# EAGLE design pcb_telemetria (EAGLE 9.5.0)
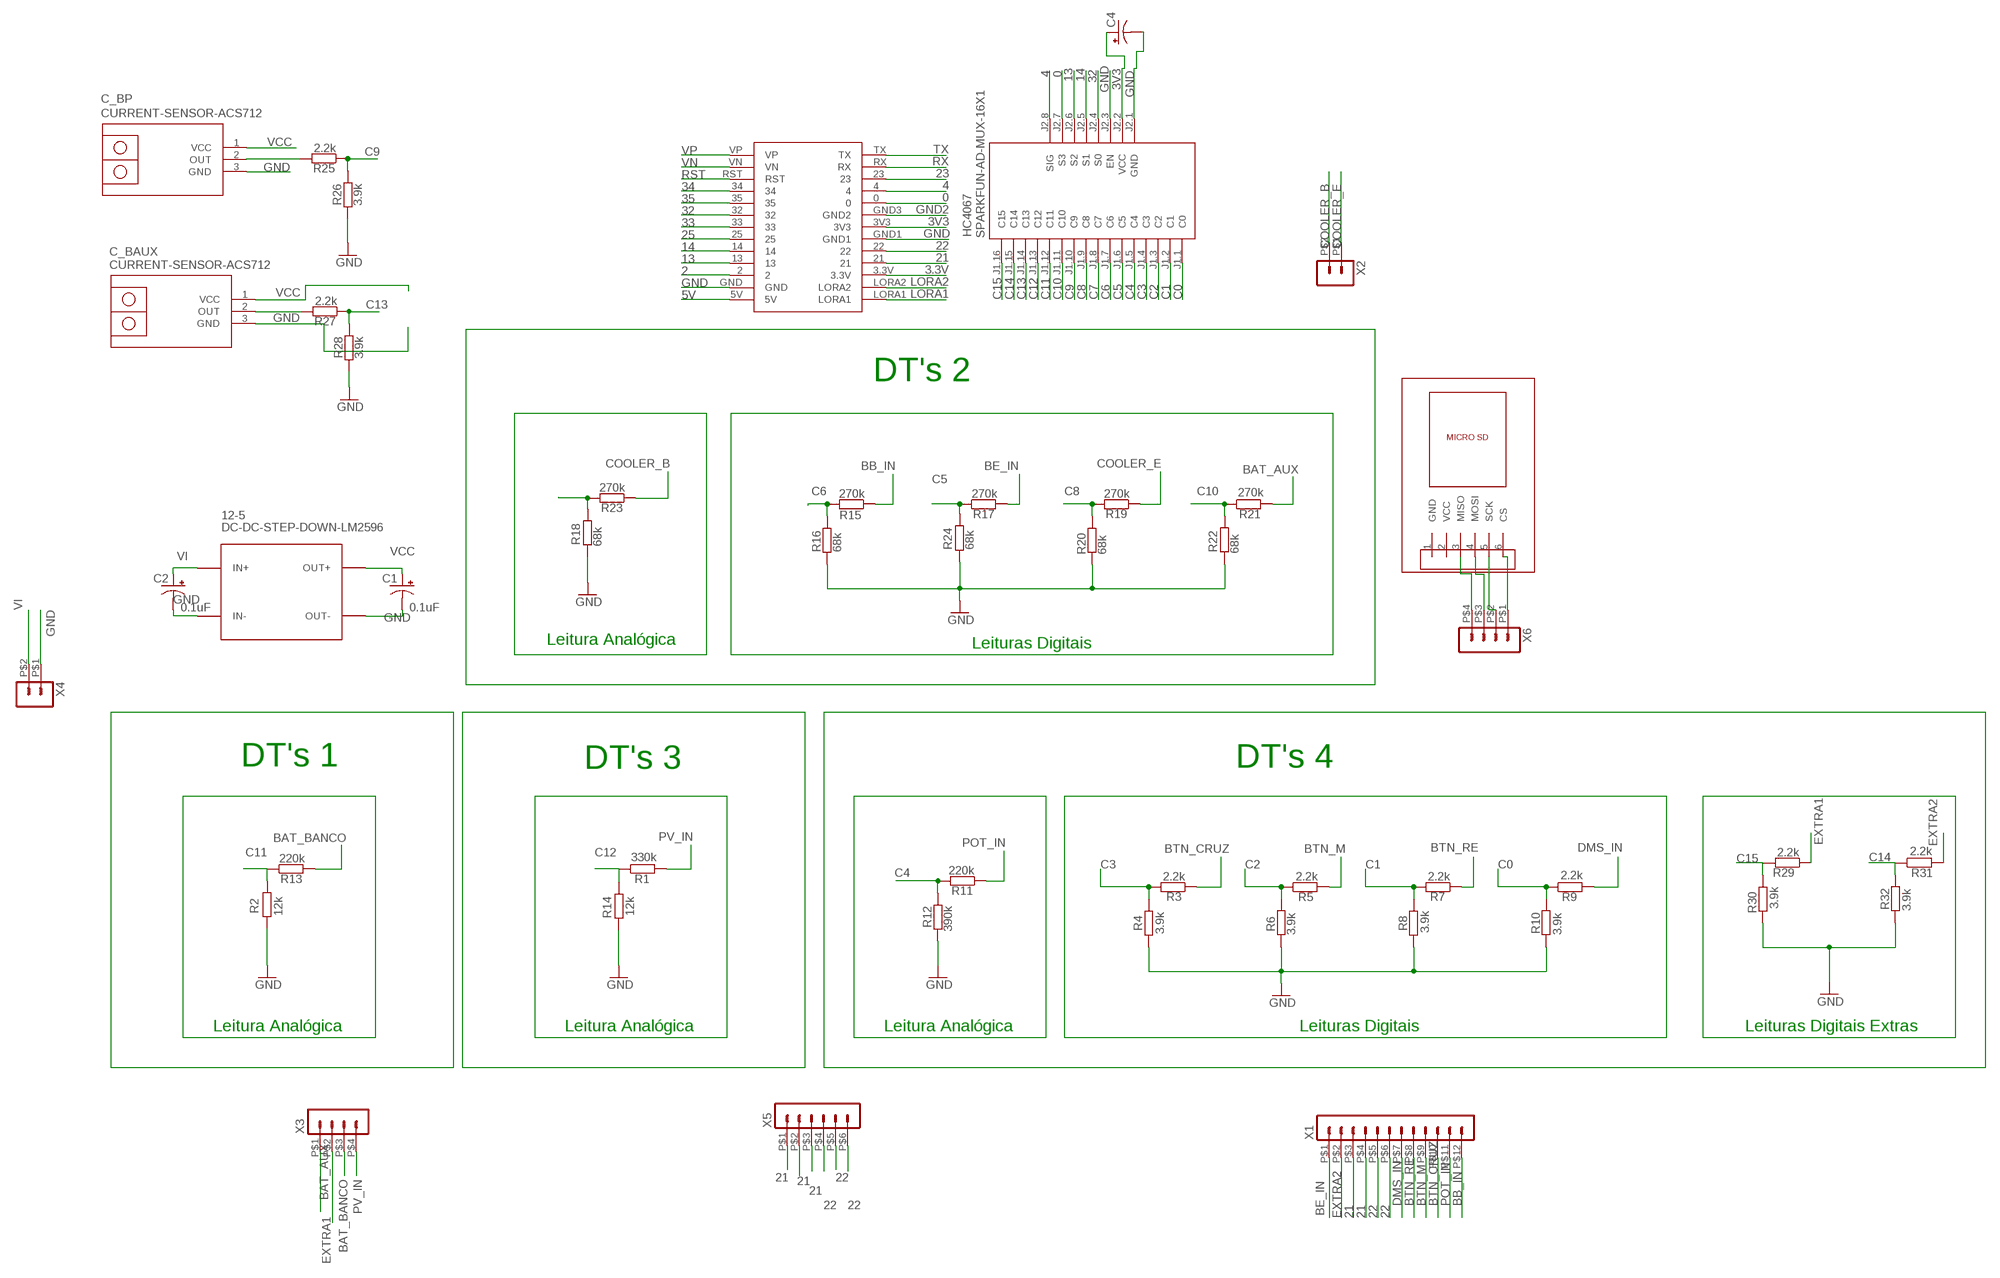
[diagram p0: schematic, sheet 1]

## Parts
12-5  DC-DC-STEP-DOWN-LM2596  [DC-DC-STEP-DOWN-LM2596]
C1  0.1uF  CPOL-USE5-5  [E5-5]
C2  0.1uF  CPOL-USE5-5  [E5-5]
C4  CPOL-USE5-5  [E5-5]
C_BAUX  CURRENT-SENSOR-ACS712  [CURRENT-SENSOR-ACS712]
C_BP  CURRENT-SENSOR-ACS712  [CURRENT-SENSOR-ACS712]
HC4067  SPARKFUN-AD-MUX-16X1  [SPARKFUN-AD-MUX-16X1]
R1  330k  R-EU_0204/7  [0204/7]
R2  12k  R-EU_0204/7  [0204/7]
R3  2.2k  R-EU_0204/7  [0204/7]
R4  3.9k  R-EU_0204/7  [0204/7]
R5  2.2k  R-EU_0204/7  [0204/7]
R6  3.9k  R-EU_0204/7  [0204/7]
R7  2.2k  R-EU_0204/7  [0204/7]
R8  3.9k  R-EU_0204/7  [0204/7]
R9  2.2k  R-EU_0204/7  [0204/7]
R10  3.9k  R-EU_0204/7  [0204/7]
R11  220k  R-EU_0204/7  [0204/7]
R12  390k  R-EU_0204/7  [0204/7]
R13  220k  R-EU_0204/7  [0204/7]
R14  12k  R-EU_0204/7  [0204/7]
R15  270k  R-EU_0204/7  [0204/7]
R16  68k  R-EU_0204/7  [0204/7]
R17  270k  R-EU_0204/7  [0204/7]
R18  68k  R-EU_0204/7  [0204/7]
R19  270k  R-EU_0204/7  [0204/7]
R20  68k  R-EU_0204/7  [0204/7]
R21  270k  R-EU_0204/7  [0204/7]
R22  68k  R-EU_0204/7  [0204/7]
R23  270k  R-EU_0204/7  [0204/7]
R24  68k  R-EU_0204/7  [0204/7]
R25  2.2k  R-EU_0204/7  [0204/7]
R26  3.9k  R-EU_0204/7  [0204/7]
R27  2.2k  R-EU_0204/7  [0204/7]
R28  3.9k  R-EU_0204/7  [0204/7]
R29  2.2k  R-EU_0204/7  [0204/7]
R30  3.9k  R-EU_0204/7  [0204/7]
R31  2.2k  R-EU_0204/7  [0204/7]
R32  3.9k  R-EU_0204/7  [0204/7]
U$1  TTGOBEAM  [TTGOBEAM]
U$2  MICRO_SD_MODULE  [MICRO_SD]
X1  HEADER_POS12_43045-1212  [43045-1212]
X2  HEADER_POS2_43045-0212  [43045-0212]
X3  HEADER_POS4_43045-0412  [43045-0412]
X4  HEADER_POS2_43045-0212  [43045-0212]
X5  HEADER_POS6_43045-0612  [43045-0612]
X6  HEADER_POS4_43045-0412  [43045-0412]

## Nets
0: HC4067.J2.7(S3) U$1.0
2: U$1.2
3.3V: U$1.3.3V
3V3: C4.+ HC4067.J2.2(VCC) U$1.3V3
4: HC4067.J2.8(SIG) U$1.4
5V: U$1.5V
13: HC4067.J2.6(S2) U$1.13
14: HC4067.J2.5(S1) U$1.14
21: U$1.21 X1.P$3 X1.P$4 X5.P$1 X5.P$2 X5.P$3
22: U$1.22 X1.P$5 X1.P$6 X5.P$4 X5.P$5 X5.P$6
23: U$1.23
25: U$1.25
32: HC4067.J2.4(S0) U$1.32
33: U$1.33
34: U$1.34
35: U$1.35
BAT_AUX: R21.2 X3.P$1
BAT_BANCO: R13.2 X3.P$3
BB_IN: R15.1 X1.P$12
BE_IN: R17.2 X1.P$1
BTN_CRUZ: R3.1 X1.P$10
BTN_M: R5.2 X1.P$9
BTN_RE: R7.1 X1.P$8
C0: HC4067.J1.1(C0) R9.1 R10.2
C1: HC4067.J1.2(C1) R7.2 R8.1
C2: HC4067.J1.3(C2) R5.1 R6.2
C3: HC4067.J1.4(C3) R3.2 R4.1
C4: HC4067.J1.5(C4) R11.2 R12.1
C5: HC4067.J1.6(C5) R17.1 R24.1
C6: HC4067.J1.7(C6) R15.2 R16.1
C7: HC4067.J1.8(C7) R18.2 R23.2
C8: HC4067.J1.9(C8) R19.2 R20.1
C9: HC4067.J1.10(C9) R25.1 R26.1
C10: HC4067.J1.11(C10) R21.1 R22.2
C11: HC4067.J1.12(C11) R2.2 R13.1
C12: HC4067.J1.13(C12) R1.1 R14.2
C13: HC4067.J1.14(C13) R27.1 R28.1
C14: HC4067.J1.15(C14) R31.1 R32.2
C15: HC4067.J1.16(C15) R29.2 R30.1
COOLER_B: R23.1 X2.P$2
COOLER_E: R19.1 X2.P$1
DMS_IN: R9.2 X1.P$7
EXTRA1: R29.1 X3.P$2
EXTRA2: R31.2 X1.P$2
GND: 12-5.IN- 12-5.OUT- C1.- C2.- C4.- C_BAUX.3(GND) C_BP.3(GND) HC4067.J2.1(GND) HC4067.J2.3(EN) R2.1 R4.2 R6.1 R8.2 R10.1 R12.2 R14.1 R16.2 R18.1 R20.2 R22.1 R26.2 R28.2 R30.2 R32.1 U$1.GND U$1.GND1 X4.P$1
GND2: U$1.GND3(GND2)
GND3: R24.2
LORA1: U$1.LORA1
LORA2: U$1.LORA2
N$1: C_BP.2(OUT) R25.2
N$2: C_BAUX.2(OUT) R27.2
N$3: U$2.3(MISO) X6.P$4
N$4: U$2.4(MOSI) X6.P$3
N$6: U$2.6(CS) X6.P$1
N$7: U$2.5(SCK) X6.P$2
POT_IN: R11.1 X1.P$11
PV_IN: R1.2 X3.P$4
RST: U$1.RST
RX: U$1.RX
TX: U$1.TX
VCC: 12-5.OUT+ C1.+ C_BAUX.1(VCC) C_BP.1(VCC)
VI: 12-5.IN+ C2.+ X4.P$2
VN: U$1.VN
VP: U$1.VP
Unconnected: U$2.1(GND) U$2.2(VCC)

## Notes on the sheet
- DT's 2
- Leitura Analógica | Leituras Digitais
- DT's 1 | DT's 3 | DT's 4
- Leitura Analógica | Leitura Analógica | Leitura Analógica | Leituras Digitais | Leituras Digitais Extras

## Library data of the parts
12-5 = diy-modules:DC-DC-STEP-DOWN-LM2596: DC/DC Step-Down Regulator based on LM2596-ADJ chip LM2596 datasheet available here: http://www.ti.com/lit/ds/symlink/lm2596.pdf Click here to find device on ebay.com <http://www.ebay.com/sch/lm2596+power+regulator>
C1 C2 C4 = rcl:CPOL-US: POLARIZED CAPACITOR, American symbol; SPICEPREFIX: C
C_BAUX C_BP = diy-modules:CURRENT-SENSOR-ACS712: Isolated Bipolar Current Sensors based on ACS712 chip More details available here: http://embedded-lab.com/blog/a-brief-overview-of-allegro-acs712-current-sensor-part-1/ Click here to find device on ebay.com <http://www.ebay.com/sch/acs712+module> Note: There are many available versions with different pinout. Please check before use
HC4067 = diy-modules:SPARKFUN-AD-MUX-16X1: SparkFun Analog/Digital MUX Breakout based on CD74HC4067 chip Source: https://www.sparkfun.com/products/9056
R1-R32 = rcl:R-EU_: RESISTOR, European symbol; SPICEPREFIX: R
U$1 = bibliotecattgo:TTGOBEAM
U$2 = bibliotecattgo:MICRO_SD_MODULE: Micro SD module
X1 = con-molex-micro-fit-3_0:HEADER_POS12_?: Molex - Micro-Fit 3.0 Series connector, 3.00mm (0.118") pitch header, 12 positions.
X2 X4 = con-molex-micro-fit-3_0:HEADER_POS2_?: Molex - Micro-Fit 3.0 Series connector, 3.00mm (0.118") pitch header, 2 positions.
X3 X6 = con-molex-micro-fit-3_0:HEADER_POS4_?: Molex - Micro-Fit 3.0 Series connector, 3.00mm (0.118") pitch header, 4 positions.
X5 = con-molex-micro-fit-3_0:HEADER_POS6_?: Molex - Micro-Fit 3.0 Series connector, 3.00mm (0.118") pitch header, 6 positions.

## Board
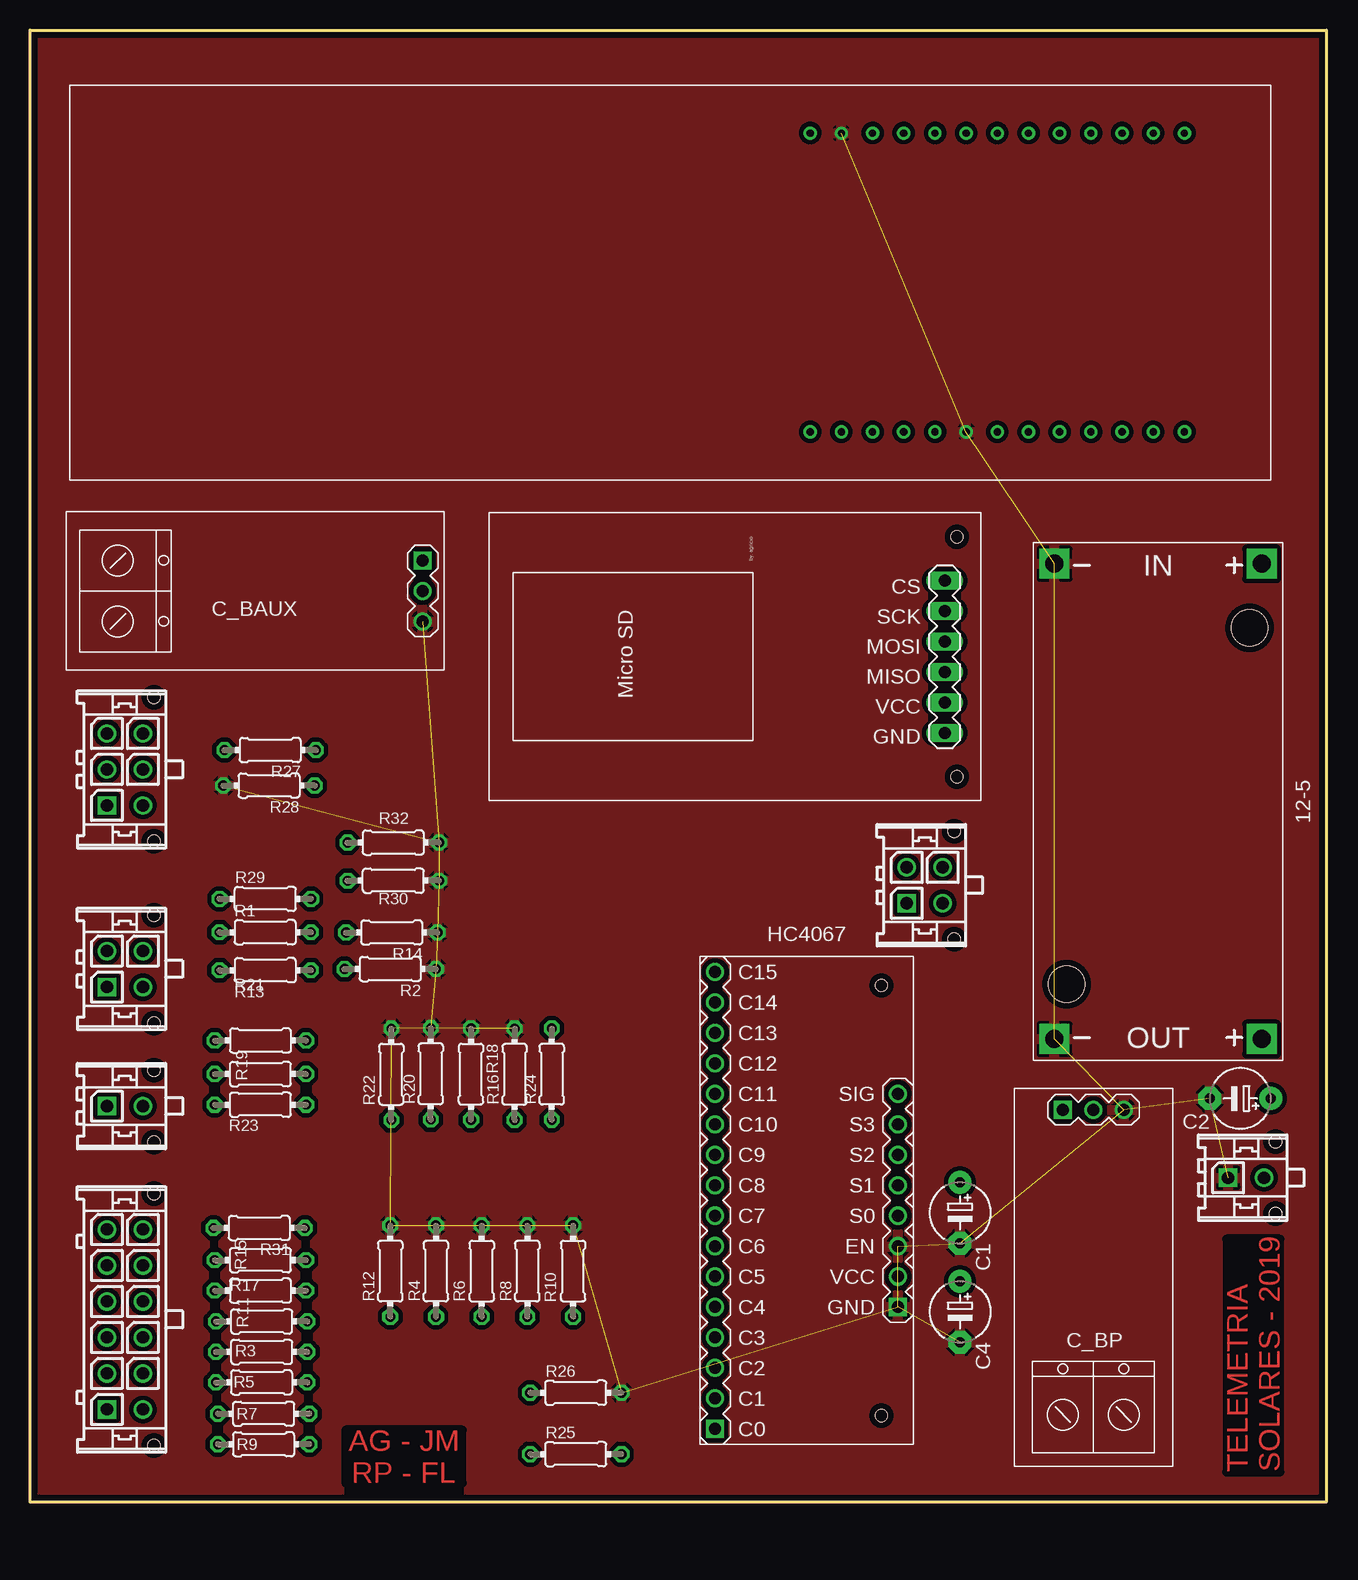
[diagram p1: board, top side]
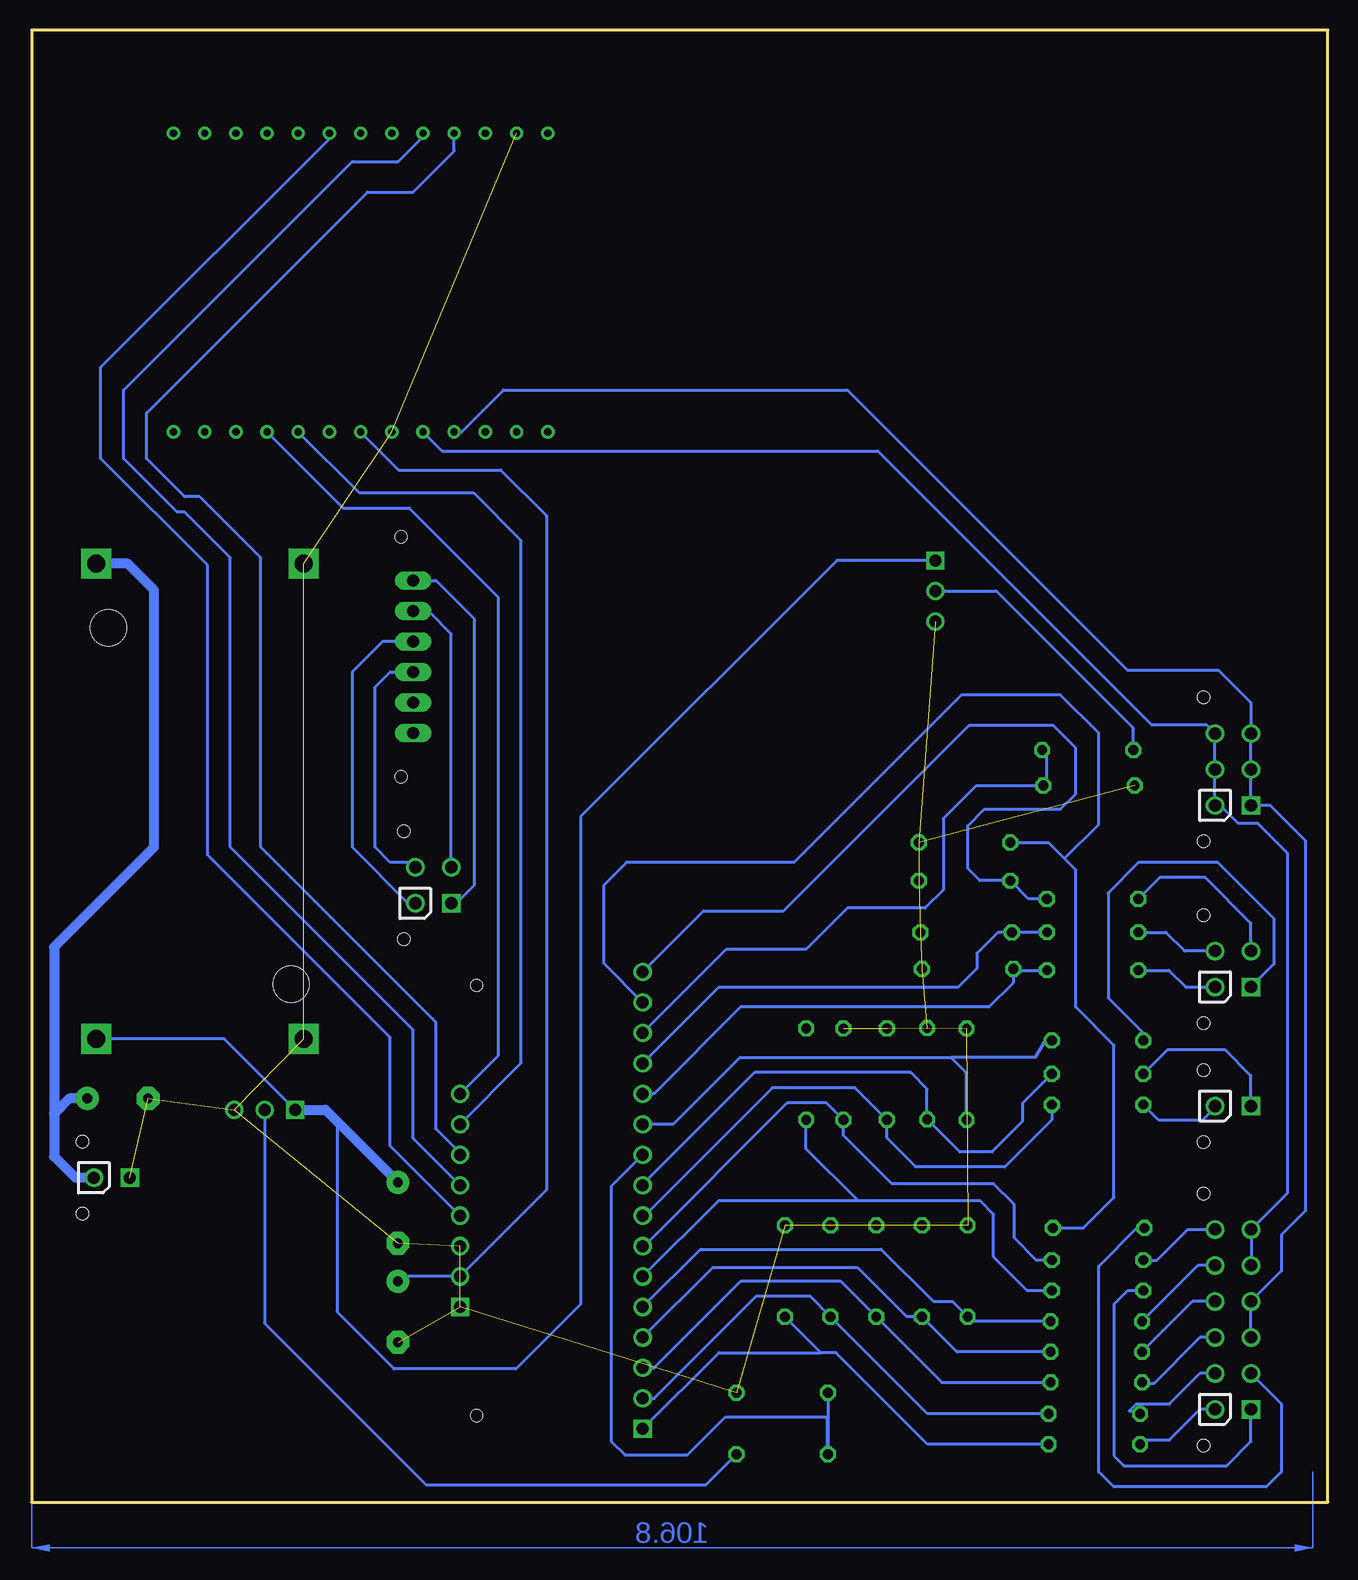
[diagram p2: board, bottom side, seen from below]

Size 108.07 x 122.73 mm. Coordinates in mm from the lower left corner, seen from the top.
Outline: 0,0 0,122.73 108.07,122.73 108.07,0 0,0
Copper layers (1*16): Top 0.035mm / dielectric 1.5mm / Bottom 0.035mm
Design rules "default *": minimum track width 10mil, minimum drill 0.35mm, track to track 15mil, track to pad 15mil, pad to pad 15mil, via to via 15mil, smd to smd 15mil, copper to edge 20mil, drill to drill 24mil, minimum pad ring 10mil, minimum via ring 8mil, stop-mask expansion 4mil, vias tented up to drill 0mil, thermal gap 10mil

### Footprints (pad centres in the part's own frame; a part is rotated, then mirrored left to right if it is on the bottom)
DC-DC-STEP-DOWN-LM2596 = drill 1.5 pad 2.5 square: IN+ -19.812,8.636; IN- -19.812,-8.636; OUT+ 19.812,8.636; OUT- 19.812,-8.636 | hole 3: -14.478,7.62; 15.24,-7.62
E5-5 = drill 0.813 pad 1.905: + -2.54,0 | drill 0.813 pad 1.905 octagon: - 2.54,0
CURRENT-SENSOR-ACS712 = drill 1 square: 1 13.97,2.54 | drill 1: 2 13.97,0; 3 13.97,-2.54
SPARKFUN-AD-MUX-16X1 = drill 1 square: J1.1 -7.62,-19.05; J2.1 7.62,-8.89 | drill 1: J1.2 -7.62,-16.51; J1.3 -7.62,-13.97; J1.4 -7.62,-11.43; J1.5 -7.62,-8.89; J1.6 -7.62,-6.35; J1.7 -7.62,-3.81; J1.8 -7.62,-1.27; J1.9 -7.62,1.27; J1.10 -7.62,3.81; J1.11 -7.62,6.35; J1.12 -7.62,8.89; J1.13 -7.62,11.43; J1.14 -7.62,13.97; J1.15 -7.62,16.51; J1.16 -7.62,19.05; J2.2 7.62,-6.35; J2.3 7.62,-3.81; J2.4 7.62,-1.27; J2.5 7.62,1.27; J2.6 7.62,3.81; J2.7 7.62,6.35; J2.8 7.62,8.89 | hole 1: 6.245,-17.93; 6.245,17.93
0204/7 = drill 0.813 octagon: 1 -3.81,0; 2 3.81,0
TTGOBEAM = drill 0.6: 0 11.9,5.8; 2 -13,-9.8; 3.3V 11.9,-9.8; 3V3 11.9,0.6; 4 11.9,8.4; 5V -13,-15; 13 -13,-7.2; 14 -13,-4.6; 21 11.9,-7.2; 22 11.9,-4.6; 23 11.9,11; 25 -13,-2; 32 -13,3.2; 33 -13,0.6; 34 -13,8.4; 35 -13,5.8; GND -13,-12.4; GND1 11.9,-2; GND3 11.9,3.2; LORA1 11.9,-15; LORA2 11.9,-12.4; RST -13,11; RX 11.9,13.6; TX 11.9,16.2; VN -13,13.6; VP -13,16.2
MICRO_SD = drill 1.016 long: 1 -6.35,0; 2 -3.81,0; 3 -1.27,0; 4 1.27,0; 5 3.81,0; 6 6.35,0 | hole 1: -10,-1; 10,-1
43045-1212 = drill 1.02 square: P$1 7.5,0 | drill 1.02: P$2 4.5,0; P$3 1.5,0; P$4 -1.5,0; P$5 -4.5,0; P$6 -7.5,0; P$7 7.5,3; P$8 4.5,3; P$9 1.5,3; P$10 -1.5,3; P$11 -4.5,3; P$12 -7.5,3 | hole 1.02: 10.5,3.94; -10.5,3.94
43045-0212 = drill 1.02 square: P$1 0,0 | drill 1.02: P$2 0,3 | hole 1.02: 3,3.94; -3,3.94
43045-0412 = drill 1.02 square: P$1 1.5,0 | drill 1.02: P$2 -1.5,0; P$3 1.5,3; P$4 -1.5,3 | hole 1.02: 4.5,3.94; -4.5,3.94
43045-0612 = drill 1.02 square: P$1 3,0 | drill 1.02: P$2 0,0; P$3 -3,0; P$4 3,3; P$5 0,3; P$6 -3,3 | hole 1.02: 6,3.94; -6,3.94

### Placement (x,y rotation side)
12-5  94.04,58.42 270 top
C1  77.53,24.13 270 top
C2  100.9,33.66 180 top
C4  77.53,15.88 270 top
C_BAUX  18.76,75.97 0 top
C_BP  88.65,18.74 90 top
HC4067  64.74,25.16 0 top
R1  19.61,47.51 180 top
R2  30.03,44.45 180 top
R3  19.31,12.53 0 top
R4  33.84,19.27 90 top
R5  19.31,9.99 180 top
R6  37.65,19.27 270 top
R7  19.47,7.37 0 top
R8  41.46,19.27 90 top
R9  19.47,4.83 180 top
R10  45.27,19.27 270 top
R11  19.31,15.07 0 top
R12  30.03,19.27 90 top
R13  19.61,44.35 180 top
R14  30.16,47.5 180 top
R15  19.21,20.18 0 top
R16  40.4,35.68 90 top
R17  19.21,17.64 180 top
R18  36.76,35.69 270 top
R19  19.21,35.7 0 top
R20  33.41,35.72 90 top
R21  19.21,38.49 180 top
R22  30.12,35.68 270 top
R23  19.21,33.14 0 top
R24  43.49,35.69 90 top
R25  45.5,4.01 0 top
R26  45.5,9.13 0 top
R27  20.02,62.7 180 top
R28  19.92,59.74 180 top
R29  19.62,50.29 0 top
R30  30.29,51.82 0 top
R31  19.11,22.86 180 top
R32  30.29,54.99 180 top
U$1  80.04,101.13 270 top
U$2  76.26,70.48 90 top
X1  6.41,15.24 270 top
X2  6.41,33.02 270 top
X3  6.41,44.45 270 top
X4  99.88,27.05 270 top
X5  6.41,61.09 270 top
X6  73.09,51.44 270 top

### Tracks (layer width: path | path; a pad name or v marks a point on that pad's centre or on a via)
0
  Bottom 0.254: HC4067.J2.7 67.24,36.63 67.24,80.16 71.24,84.15 80.76,84.15 U$1.0
3V3
  Bottom 0.254: U$1.3V3 77.47,86.05 68.96,86.05 65.15,82.24 65.15,26.02 HC4067.J2.2 77.13,18.81 C4.+
4
  Bottom 0.254: HC4067.J2.8 69.18,37.23 69.18,75.47 76.59,82.88 82.09,82.88 U$1.4
13
  Bottom 0.254: HC4067.J2.6 72.36,29.12 74.36,31.12 74.36,40.01 88.96,54.61 88.96,78.74 94.04,83.82 95.31,83.82 98.49,86.99 98.49,90.8 80.07,109.22 76.26,109.22 72.84,112.64 U$1.13
14
  Bottom 0.254: HC4067.J2.5 76.26,30.33 76.26,39.37 91.5,54.61 91.5,78.74 95.31,82.55 95.95,82.55 100.39,86.99 100.39,92.71 81.34,111.76 77.53,111.76 75.44,113.85 U$1.14
21
  Bottom 0.254: X1.P$3 X1.P$4 3.87,19.28 3.87,22.28 1.84,24.31 1.84,55.12 4.81,58.09 X5.P$1 X5.P$2 X5.P$3 6.41,66.63 6.4,66.64 9.1,69.34 16.7,69.34 40.07,92.71 68.72,92.71 72.21,89.23 U$1.21
22
  Bottom 0.254: U$1.22 73.84,87.63 37.53,87.63 14.67,64.77 10.09,64.77 X5.P$6 X5.P$5 9.41,58.42 | X5.P$4 9.41,58.42 | X1.P$6 6.35,22.8 | 6.35,22.8 3.36,25.79 3.36,54.1 5.85,56.59 7.48,56.59 9.32,58.42 9.41,58.42 | X1.P$5 6.35,19.8 6.35,22.8
32
  Bottom 0.254: HC4067.J2.4 78.17,29.7 78.17,38.73 93.41,53.98 93.41,78.1 102.3,86.99 102.3,94.61 83.24,113.67 U$1.32
BAT_AUX
  Bottom 0.254: R21.2 15.4,39.13 18.32,42.05 18.32,50.81 15.76,53.36 9.2,53.36 4.51,48.66 4.51,44.86 X3.P$1
BAT_BANCO
  Bottom 0.254: R13.2 13.26,44.35 11.86,42.95 X3.P$3
BB_IN
  Bottom 0.254: R15.1 14.25,20.18 11.7,22.74 X1.P$12
BE_IN
  Bottom 0.254: R17.2 16.71,17.64 17.84,16.51 17.84,3.89 17,3.05 8.44,3.05 6.41,5.08 X1.P$1
BTN_CRUZ
  Bottom 0.254: R3.1 11.29,16.74 X1.P$10
BTN_M
  Bottom 0.254: R5.2 15.43,9.93 14.49,9.93 10.68,13.74 X1.P$9
BTN_RE
  Bottom 0.254: R7.1 15.9,7.61 16.56,7.61 15.98,8.2 13.22,8.2 10.68,10.74 X1.P$8
C0
  Bottom 0.254: R9.1 33.38,4.83 41.01,12.46 42.28,12.46 | 42.28,12.46 R10.2 | HC4067.J1.1 50.77,12.46 42.28,12.46
C1
  Bottom 0.254: R7.2 33.38,7.37 R8.1 43.15,17.14 47.69,17.14 56.18,8.65 HC4067.J1.2
C2
  Bottom 0.254: R5.1 32.19,9.99 R6.2 40.61,18.41 48.96,18.41 56.18,11.19 HC4067.J1.3
C3
  Bottom 0.254: R3.2 30.92,12.53 R4.1 35.11,15.46 39.23,19.57 51.28,19.57 HC4067.J1.4
C4
  Bottom 0.254: HC4067.J1.5 52.29,21.1 37.24,21.1 32.88,16.73 31.3,16.73 R12.1 29.65,15.07 R11.2
C5
  Bottom 0.254: R17.1 25.05,17.64 27.87,20.47 27.87,24 29.02,25.15 39.18,25.15 39.19,25.16 | HC4067.J1.6 50.77,25.16 39.19,25.16 | R24.1 43.49,29.46 39.19,25.16
C6
  Bottom 0.254: HC4067.J1.7 57.01,21.35 45.09,33.27 41.8,33.27 R16.1 40.4,30.6 36.34,26.54 27.87,26.54 26.19,24.86 26.19,22.09 24.29,20.18 R15.2
C7
  Bottom 0.254: HC4067.J1.8 56.96,23.89 46.31,34.54 39.43,34.54 R18.2 36.76,30.35 34.35,27.94 26.94,27.94 23.02,31.87 R23.2
C8
  Bottom 0.254: HC4067.J1.9 57.12,26.48 47.78,35.81 34.78,35.81 33.41,34.45 R20.1 30.7,29.2 28.01,29.2 25.46,31.75 25.46,33.25 R19.2
C9
  Bottom 0.254: HC4067.J1.10 59.75,26.34 59.75,5.08 58.61,3.94 53.4,3.94 50.23,7.11 41.76,7.11 41.76,4.08 R25.1 R26.1
C10
  Bottom 0.254: HC4067.J1.11 54.58,31.51 49.01,37.08 31.43,37.08 | 31.43,37.08 24.4,37.08 23.56,38.49 R21.1 | R22.2 30.12,35.77 31.43,37.08
C11
  Bottom 0.254: HC4067.J1.12 56.18,34.05 48.96,41.27 28.25,41.27 26.22,43.31 R2.2 26.22,44.35 R13.1
C12
  Bottom 0.254: HC4067.J1.13 50.77,42.94 30.82,42.94 29.27,44.49 29.27,45.76 27.49,47.54 26.39,47.54 R14.2 26.33,47.51 R1.1
C13
  Bottom 0.254: HC4067.J1.14 50.13,46.12 43.48,46.12 40.07,49.53 33.59,49.53 32.06,51.05 32.06,57 29.32,59.74 R28.1 23.45,60.02 23.45,62.32 R27.1
C14
  Bottom 0.254: R31.1 20.38,22.86 17.84,25.4 17.84,38.1 21.02,41.27 21.02,52.7 21.97,53.66 | R32.2 23.3,54.99 21.97,53.66 | 21.97,53.66 19.11,56.52 19.11,64.13 22.29,67.31 30.54,67.31 44.51,53.34 58.48,53.34 60.39,51.44 60.39,44.94 HC4067.J1.15
C15
  Bottom 0.254: R29.2 24.95,50.29 R30.1 29.02,51.82 30.03,52.83 30.03,56.39 28.64,57.79 22.29,57.79 21.02,59.05 21.02,62.87 22.92,64.77 29.91,64.77 45.38,49.29 52.04,49.29 HC4067.J1.16
COOLER_B
  Bottom 0.254: X2.P$2 9.28,33.02 10.43,31.88 14.14,31.88 R23.1
COOLER_E
  Bottom 0.254: X2.P$1 6.41,35.56 8.57,37.72 13.38,37.72 R19.1
DMS_IN
  Bottom 0.254: X1.P$7 10.68,7.74 13.22,5.2 15.29,5.2 R9.2
EXTRA1
  Bottom 0.254: X3.P$2 6.41,48.26 10.22,52.07 14.03,52.07 R29.1
EXTRA2
  Bottom 0.254: X1.P$2 3.87,8.2 3.87,2.54 5.14,1.27 17.84,1.27 19.11,2.54 19.11,19.69 15.94,22.86 R31.2
GND  (26 unrouted)
  pour Top: -7.56,122.55 -7.56,-16.51 -5.02,-19.05 123.89,-19.05 125.79,-17.15 125.79,109.85 110.55,125.09 -5.65,125.09 -8.19,122.55
N$1
  Bottom 0.254: C_BP.2 88.65,14.93 75.19,1.47 51.85,1.47 R25.2
N$2
  Bottom 0.254: C_BAUX.2 27.65,75.97 16.21,64.53 R27.2
N$3
  Bottom 0.254: X6.P$4 76.49,53.34 78.17,53.34 79.44,54.61 79.44,67.94 78.17,69.22 U$2.3
N$4
  Bottom 0.254: U$2.4 78.8,71.75 81.34,69.22 81.34,54.61 76.67,49.94 X6.P$3
N$6
  Bottom 0.254: U$2.6 74.36,76.83 71.18,73.66 71.18,51.44 72.68,49.94 X6.P$1
N$7
  Bottom 0.254: X6.P$2 73.09,72.39 74.99,74.29 U$2.5
POT_IN
  Bottom 0.254: R11.1 10.83,19.74 X1.P$11
PV_IN
  Bottom 0.254: R1.2 13.51,47.51 11.95,45.95 X3.P$4
VCC
  Bottom 0.254: C_BAUX.1 40.93,78.51 62.29,57.15 62.29,16.51 67.69,11.11 77.85,11.11 82.61,15.88 82.61,31.75 | C_BP.1 92.01,38.61 12-5.OUT+
  Bottom 0.813: C_BP.1 83.57,32.71 82.61,31.75 C1.+
VI
  Bottom 0.813: 12-5.IN+ 100.05,78.23 97.85,76.03 97.85,54.61 106.18,46.28 106.18,32.38 | 106.18,32.38 106.18,28.83 104.41,27.05 X4.P$2 | C2.+ 104.91,33.66 106.18,32.38
(copper drawn outside any net)
  shapes: Bottom area x1

### Text on the board
Top: AG - JM / RP - FL | TELEMETRIA / SOLARES - 2019